# EAGLE design Kosmos-X3000-FM-Superregen (EAGLE 7.6.0)
Kosmos X3000, UKW-Pendler mit FET 11.Mar.09 11:01 by Wolfgang Holtmann http://www.radiomuseum.org/forum/kosmos_x3000_ukw_pendler_mit_fet.html
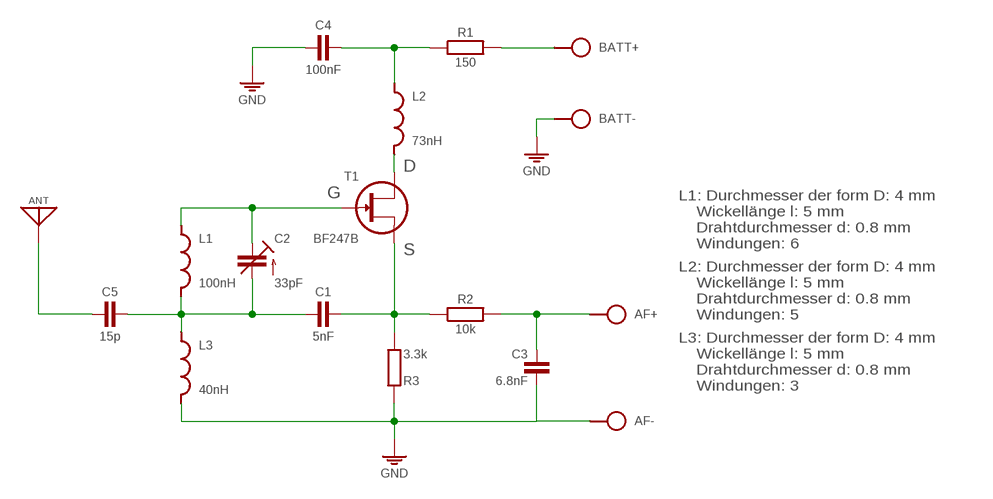
[diagram p0: schematic, sheet 1]

## Parts
AF  SPAD+-+-  [SPAD+-]
ANT  ANT  [SPAD]
BATT  SPAD+-+-  [SPAD+-]
C1  5nF  C050-020X044  [C050-020X044]
C2  33pF  C-TR-PH201272222-808-2PIN  [TRIM-2222-808]
C3  6.8nF  C050-020X044  [C050-020X044]
C4  100nF  C050-020X044  [C050-020X044]
C5  15p  C025-015X024  [C025-015X024]
L1  100nH  L-SHORT04-5/5V  [L-04-5/5V]
L2  73nH  L-SHORT04-5/5V  [L-04-5/5V]
L3  40nH  L-SHORT04-5/5V  [L-04-5/5V]
R1  150  R-H0202/7-V  [0202/7-V]
R2  10k  R-H0202/7  [0202/7]
R3  3.3k  R0202/7  [0202/7]
T1  BF247B  [TO92]

## Nets
GND: AF.1 BATT.1 C3.2 C4.2 L3.1 R3.2
N$1: C2.1(E) L1.2 T1.3(G)
N$2: C1.2 C2.2(A) C5.1 L1.1 L3.2
N$3: C4.1 L2.2 R1.1
N$4: AF.2 C3.1 R2.2
N$5: C1.1 R2.1 R3.1 T1.2(S)
N$6: L2.1 T1.1(D)
N$7: BATT.2 R1.2
N$8: ANT.1 C5.2

## Notes on the sheet
- L1: Durchmesser der form D: 4 mm
      Wickellänge l: 5 mm
      Drahtdurchmesser d: 0.8 mm
      Windungen: 6
- L2: Durchmesser der form D: 4 mm
      Wickellänge l: 5 mm
      Drahtdurchmesser d: 0.8 mm
      Windungen: 5
- L3: Durchmesser der form D: 4 mm
      Wickellänge l: 5 mm
      Drahtdurchmesser d: 0.8 mm
      Windungen: 3

## Library data of the parts
AF BATT = pad:SPAD+-
ANT = pad:ANT
C1 C3-C5 = c:C: CAPACITOR, European symbol
C2 = cap-trim:C-TR-PH20127
L1-L3 = l:L-SHORT
R1 R2 = r:R-H
R3 = r:R: RESISTOR, European symbol
T1 = t:BF247B

## Net classes
0 default: width 0.61 mm

## Board
Kosmos X3000, UKW-Pendler mit FET 11.Mar.09 11:01 by Wolfgang Holtmann http://www.radiomuseum.org/forum/kosmos_x3000_ukw_pendler_mit_fet.html
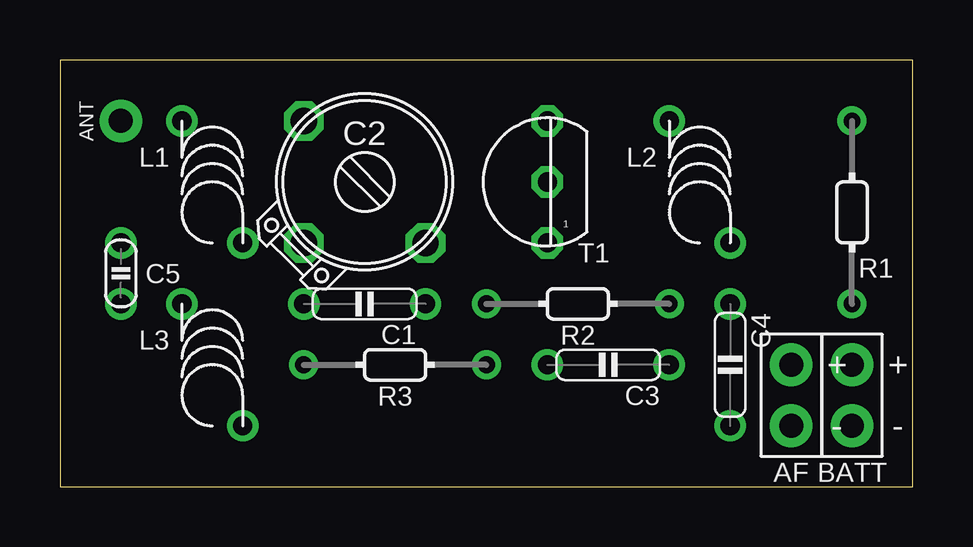
[diagram p1: board, top side]
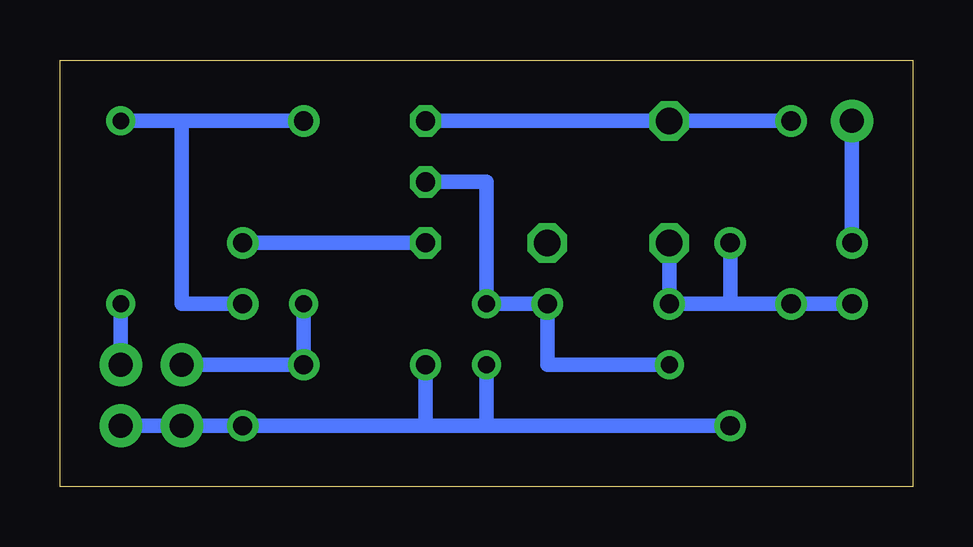
[diagram p2: board, bottom side, seen from below]

Size 35.56 x 17.78 mm. Coordinates in mm from the lower left corner, seen from the top.
Outline: 0,0 35.56,0 35.56,17.78 0,17.78 0,0
Copper layers (1*16): Top 0.035mm / dielectric 1.5mm / Bottom 0.035mm
Design rules "default": minimum track width 10mil, minimum drill 24mil, track to track 8mil, track to pad 8mil, pad to pad 8mil, via to via 8mil, smd to smd 8mil, copper to edge 40mil, drill to drill 8mil, minimum pad ring 10mil, minimum via ring 8mil, stop-mask expansion 4mil, vias tented up to drill 0mil, thermal gap 10mil

### Footprints (pad centres in the part's own frame; a part is rotated, then mirrored left to right if it is on the bottom)
SPAD+- = drill 1 pad 1.778: 1 0,-1.27; 2 0,1.27
SPAD = drill 1 pad 1.778: 1 0,0
C050-020X044 = drill 0.8: 1 -2.54,0; 2 2.54,0
TRIM-2222-808 = drill 1.1 octagon: 1 -2.54,2.54; 2 -2.54,-2.54; 3 2.54,-2.54
C025-015X024 = drill 0.8: 1 0,1.27; 2 0,-1.27
L-04-5/5V = drill 0.8: 1 1.27,-2.54; 2 -1.27,2.54
0202/7-V = drill 0.7: 1 0,-3.81; 2 0,3.81
0202/7 = drill 0.7: 1 0,3.81; 2 0,-3.81
TO92 = drill 0.8 octagon: 1 0,2.54; 2 0,0; 3 0,-2.54

### Placement (x,y rotation side)
AF  30.48,3.81 0 top
ANT  2.54,15.24 0 top
BATT  33.02,3.81 0 top
C1  12.7,7.62 180 top
C2  12.7,12.7 0 top
C3  22.86,5.08 180 top
C4  27.94,5.08 270 top
C5  2.54,8.89 180 top
L1  6.35,12.7 0 top
L2  26.67,12.7 0 top
L3  6.35,5.08 0 top
R1  33.02,11.43 180 top
R2  21.59,7.62 90 top
R3  13.97,5.08 90 top
T1  20.32,12.7 180 top

### Tracks (layer width: path | path; a pad name or v marks a point on that pad's centre or on a via)
GND
  Bottom 0.61: 20.32,2.54 17.78,2.54 | 17.78,2.54 L3.1 AF.1 | BATT.1 AF.1 | AF.1 C4.2 20.32,2.54 | C3.2 20.32,2.54 | R3.2 17.78,2.54
N$1
  Bottom 0.61: T1.3 C2.1 L1.2
N$2
  Bottom 0.61: C2.2 C1.2 7.62,7.62 | L1.1 7.62,7.62 | 7.62,7.62 L3.2 C5.1
N$3
  Bottom 0.61: R1.1 30.48,15.24 | L2.2 30.48,15.24 | 30.48,15.24 30.48,7.62 C4.1
N$4
  Bottom 0.61: R2.2 C3.1 AF.2
N$5
  Bottom 0.61: R3.1 15.24,5.08 C1.1 R2.1 17.78,12.7 T1.2
N$6
  Bottom 0.61: T1.1 L2.1
N$7
  Bottom 0.61: R1.2 BATT.2
N$8
  Bottom 0.61: C5.2 ANT.1